# EAGLE schematic 1FA (EAGLE 9.4.2)
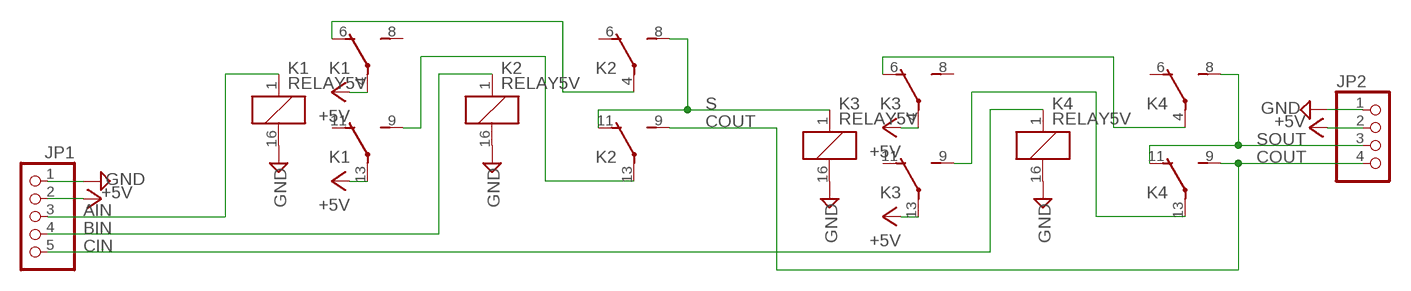
[diagram p0: schematic, sheet 1]

## Parts
JP1  PINHD-1X5  [1X05]
JP2  PINHD-1X4  [1X04]
K1  RELAY5V  [DS-BT]
K2  RELAY5V  [DS-BT]
K3  RELAY5V  [DS-BT]
K4  RELAY5V  [DS-BT]

## Nets
+5V: JP1.2 JP2.2 K1.4(2:P) K1.13(3:P) K3.4(2:P) K3.13(3:P)
AIN: JP1.3 K1.1(1:+)
BIN: JP1.4 K2.1(1:+)
CIN: JP1.5 K4.1(1:+)
COUT: JP2.4 K2.9(3:S) K4.9(3:S)
GND: JP1.1 JP2.1 K1.16(1:-) K2.16(1:-) K3.16(1:-) K4.16(1:-)
N$1: K3.9(3:S) K4.13(3:P)
N$2: K1.9(3:S) K2.13(3:P)
N$3: K1.6(2:O) K2.4(2:P)
N$4: K3.6(2:O) K4.4(2:P)
S: K2.8(2:S) K2.11(3:O) K3.1(1:+)
SOUT: JP2.3 K4.8(2:S) K4.11(3:O)
Unconnected: K1.8(2:S) K1.11(3:O) K2.6(2:O) K3.8(2:S) K3.11(3:O) K4.6(2:O)

## Library data of the parts
JP1 = pinhead:PINHD-1X5: PIN HEADER
JP2 = pinhead:PINHD-1X4: PIN HEADER
K1-K4 = My:RELAY: DS-BT RELAYS 4,000 V BREAKDOWN VOLTAGE NAiS Source: http://www.mew-europe.com/.. en_ds_61005_0010.pdf